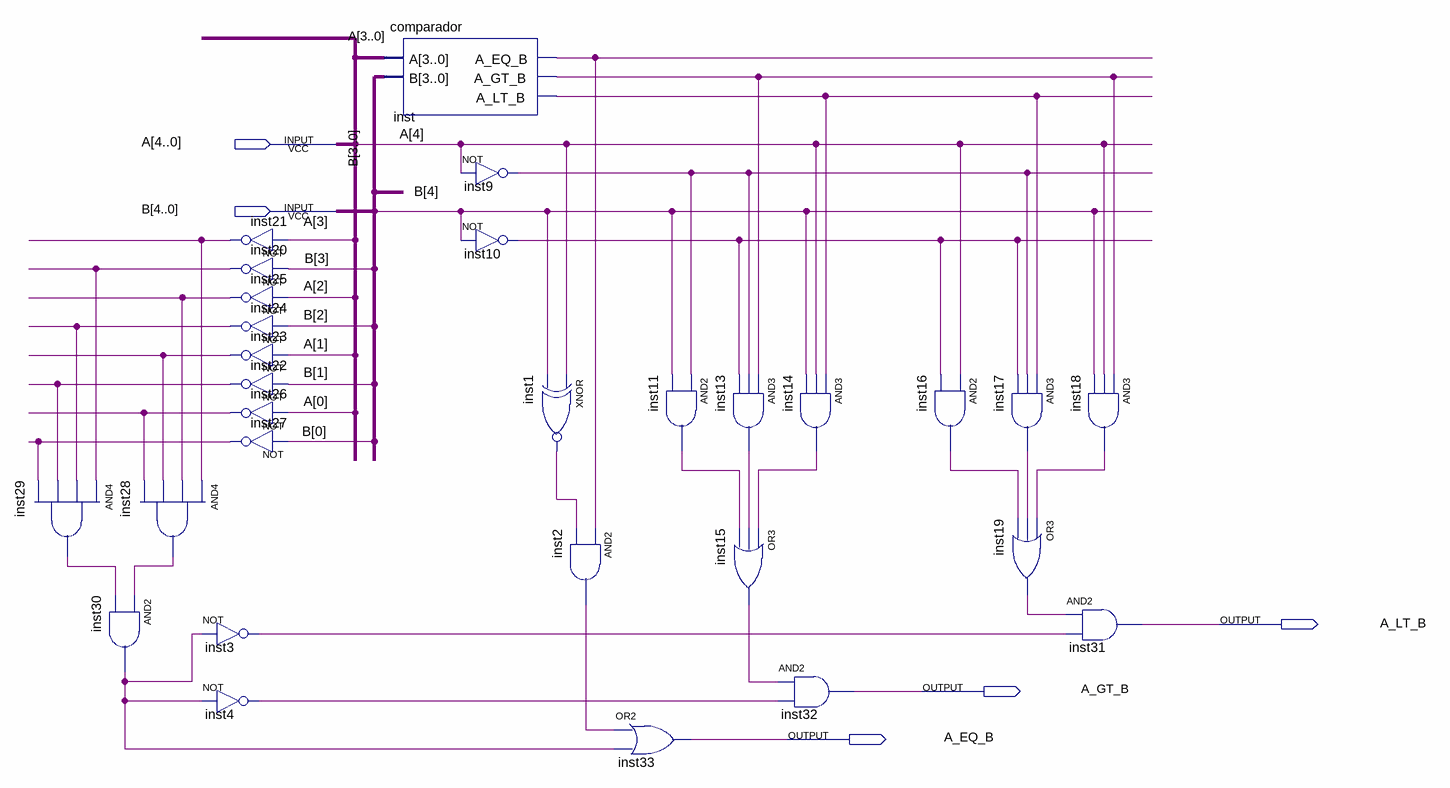
[diagram p0: schematic sheet]
// Quartus schematic comparadorCompleto.bdf as structural Verilog: 29 symbols, 5 pins
module comparadorCompleto (
  input  [4:0] A,
  input  [4:0] B,
  output A_LT_B,
  output A_GT_B,
  output A_EQ_B
);

  wire inst1_out, inst2_out, inst3_out, inst4_out, inst9_out, inst10_out, inst11_out, inst13_out, inst14_out,
       inst15_out, inst16_out, inst17_out, inst18_out, inst19_out, inst20_out, inst21_out, inst22_out,
       inst23_out, inst24_out, inst25_out, inst26_out, inst27_out, inst28_out, inst29_out, inst30_out,
       inst_a_eq_b, inst_a_gt_b, inst_a_lt_b;

  and inst29 (inst29_out, inst20_out, inst24_out, inst22_out, inst27_out);
  and inst28 (inst28_out, inst21_out, inst25_out, inst23_out, inst26_out);
  and inst30 (inst30_out, inst28_out, inst29_out);
  not inst21 (inst21_out, A[3]);
  not inst20 (inst20_out, B[3]);
  not inst25 (inst25_out, A[2]);
  not inst24 (inst24_out, B[2]);
  not inst23 (inst23_out, A[1]);
  not inst22 (inst22_out, B[1]);
  not inst26 (inst26_out, A[0]);
  not inst27 (inst27_out, B[0]);
  not inst3 (inst3_out, inst30_out);
  not inst4 (inst4_out, inst30_out);
  comparador inst (.A(A[3:0]), .B(B[3:0]), .A_EQ_B(inst_a_eq_b), .A_GT_B(inst_a_gt_b), .A_LT_B(inst_a_lt_b));
  not inst9 (inst9_out, A[4]);
  not inst10 (inst10_out, B[4]);
  xnor inst1 (inst1_out, A[4], B[4]);
  and inst2 (inst2_out, inst_a_eq_b, inst1_out);
  or inst33 (A_EQ_B, inst2_out, inst30_out);
  and inst11 (inst11_out, inst9_out, B[4]);
  and inst13 (inst13_out, inst_a_gt_b, inst9_out, inst10_out);
  or inst15 (inst15_out, inst14_out, inst13_out, inst11_out);
  and inst14 (inst14_out, inst_a_lt_b, A[4], B[4]);
  and inst32 (A_GT_B, inst15_out, inst4_out);
  and inst16 (inst16_out, A[4], inst10_out);
  and inst17 (inst17_out, inst_a_lt_b, inst9_out, inst10_out);
  or inst19 (inst19_out, inst18_out, inst17_out, inst16_out);
  and inst18 (inst18_out, inst_a_gt_b, A[4], B[4]);
  and inst31 (A_LT_B, inst19_out, inst3_out);
endmodule
